# EAGLE design brvrbt (EAGLE 8.2.2)
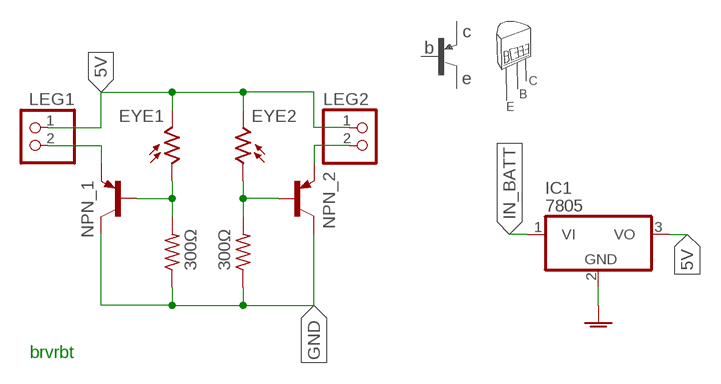
[diagram p0: schematic, sheet 1]

## Parts
EYE1  A1050_09  [T0-46-A10XX]
EYE2  A1050_09  [T0-46-A10XX]
IC1  7805  7805TV  [TO220V]
LEG1  HEADER-1X2  [1X02_OVAL]
LEG2  HEADER-1X2  [1X02_OVAL]
NPN_1  BC327-16-PNP-TO92-EBC  [TO92-EBC]
NPN_2  E B C  BC327-16-PNP-TO92-EBC  [TO92-EBC]
R1  300Ω  R-US_0207/7  [0207/7]
R2  300Ω  R-US_0207/7  [0207/7]

## Nets
5V: EYE1.2 EYE2.2 IC1.3(VO) LEG1.1 LEG2.1
BASE_1: EYE2.1 NPN_2.B R2.2
BASE_2: EYE1.1 NPN_1.B R1.2
COLLECTOR_1: LEG2.2 NPN_2.E
COLLECTOR_2: LEG1.2 NPN_1.E
GND: IC1.2(GND) NPN_1.C NPN_2.C R1.1 R2.1 ; supply symbol labelled AGND
IN_BATT: IC1.1(VI)

## Notes on the sheet
- c
- b
- e
- C
- B
- E
- brvrbt

## Library data of the parts
EYE1 EYE2 = photo-elements:A10: Sensor Robust Light Sensing Applications Outdoor Light Sensing Application Source: http://optoelectronics.perkinelmer.com/content/Datasheets/DTS_PhotocellsA1050.pdf
IC1 = linear:78*: Positive VOLTAGE REGULATOR Source: http://cache.national.com/ds/LM/LM78L05.pdf http://www.fairchildsemi.com/ds/LM/LM7805.pdf
LEG1 LEG2 = microbuilder:HEADER-1X2: PIN HEADER
NPN_1 NPN_2 = transistor:*-PNP-: PNP Transistror
R1 R2 = adafruit:R-US_: RESISTOR, American symbol

## Board
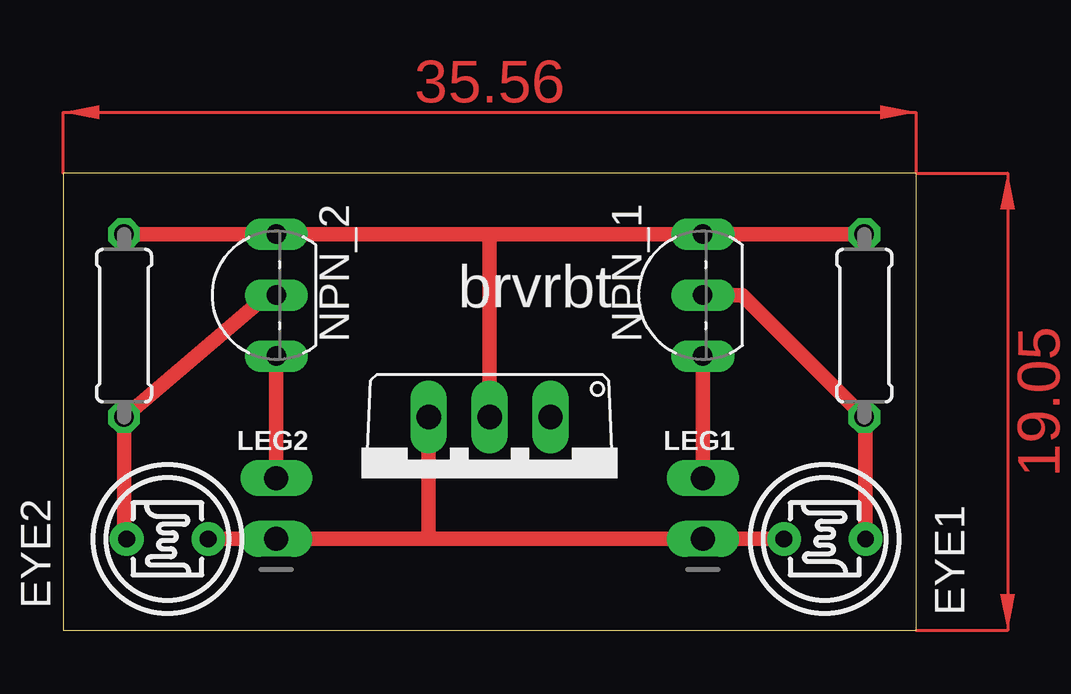
[diagram p1: board, top side]

Size 35.56 x 19.05 mm. Coordinates in mm from the lower left corner, seen from the top.
Outline: 0,0 35.56,0 35.56,19.05 0,19.05 0,0
Copper layers (1*16): Top 0.035mm / dielectric 1.5mm / Bottom 0.035mm
Design rules "default": minimum track width 6mil, minimum drill 0.35mm, track to track 6mil, track to pad 6mil, pad to pad 6mil, via to via 6mil, smd to smd 6mil, copper to edge 40mil, drill to drill 6mil, minimum pad ring 10mil, minimum via ring 8mil, stop-mask expansion 4mil, vias tented up to drill 0mil, thermal gap 10mil

### Footprints (pad centres in the part's own frame; a part is rotated, then mirrored left to right if it is on the bottom)
T0-46-A10XX = drill 0.7 pad 1.4: 1 -1.7,0; 2 1.7,0
TO220V = drill 1.016 long: 1 -2.54,-2.54; 2 0,-2.54; 3 2.54,-2.54
1X02_OVAL = drill 1 long: 1 -1.27,0; 2 1.27,0
TO92-EBC = drill 0.813 long: B 0,-1.27; C 2.54,-1.27; E -2.54,-1.27
0207/7 = drill 0.813 octagon: 1 -3.81,0; 2 3.81,0

### Placement (x,y rotation side)
EYE1  31.75,3.81 180 top
EYE2  4.35,3.81 0 top
IC1  17.78,6.35 180 top
LEG1  26.67,5.08 90 top
LEG2  8.89,5.08 90 top
NPN_1  25.4,13.97 90 top
NPN_2  7.62,13.97 90 top
R1  33.4,12.7 270 top
R2  2.54,12.7 270 top

### Tracks (layer width: path | path; a pad name or v marks a point on that pad's centre or on a via)
5V
  Top 0.406: LEG2.1 12.38,3.81
  Top 0.61: EYE1.2 LEG1.1 15.24,3.81 | 12.38,3.81 EYE2.2 | IC1.3 15.24,3.81 | 15.24,3.81 LEG2.1
BASE_1
  Top 0.61: NPN_2.B 8.51,13.97 R2.2 2.54,3.92 EYE2.1
BASE_2
  Top 0.61: NPN_1.B 28.32,13.97 R1.2 33.45,8.89 EYE1.1
COLLECTOR_1
  Top 0.61: LEG2.2 NPN_2.E
COLLECTOR_2
  Top 0.61: NPN_1.E LEG1.2
GND
  Top 0.61: R2.1 NPN_2.C 17.78,16.51 | R1.1 NPN_1.C 17.78,16.51 | IC1.2 17.78,16.51
(copper drawn outside any net)
  shapes: Top area x2

### Text on the board
tPlace: brvrbt